# Altium project WS2812LatticeScreen_Project.PrjPcb
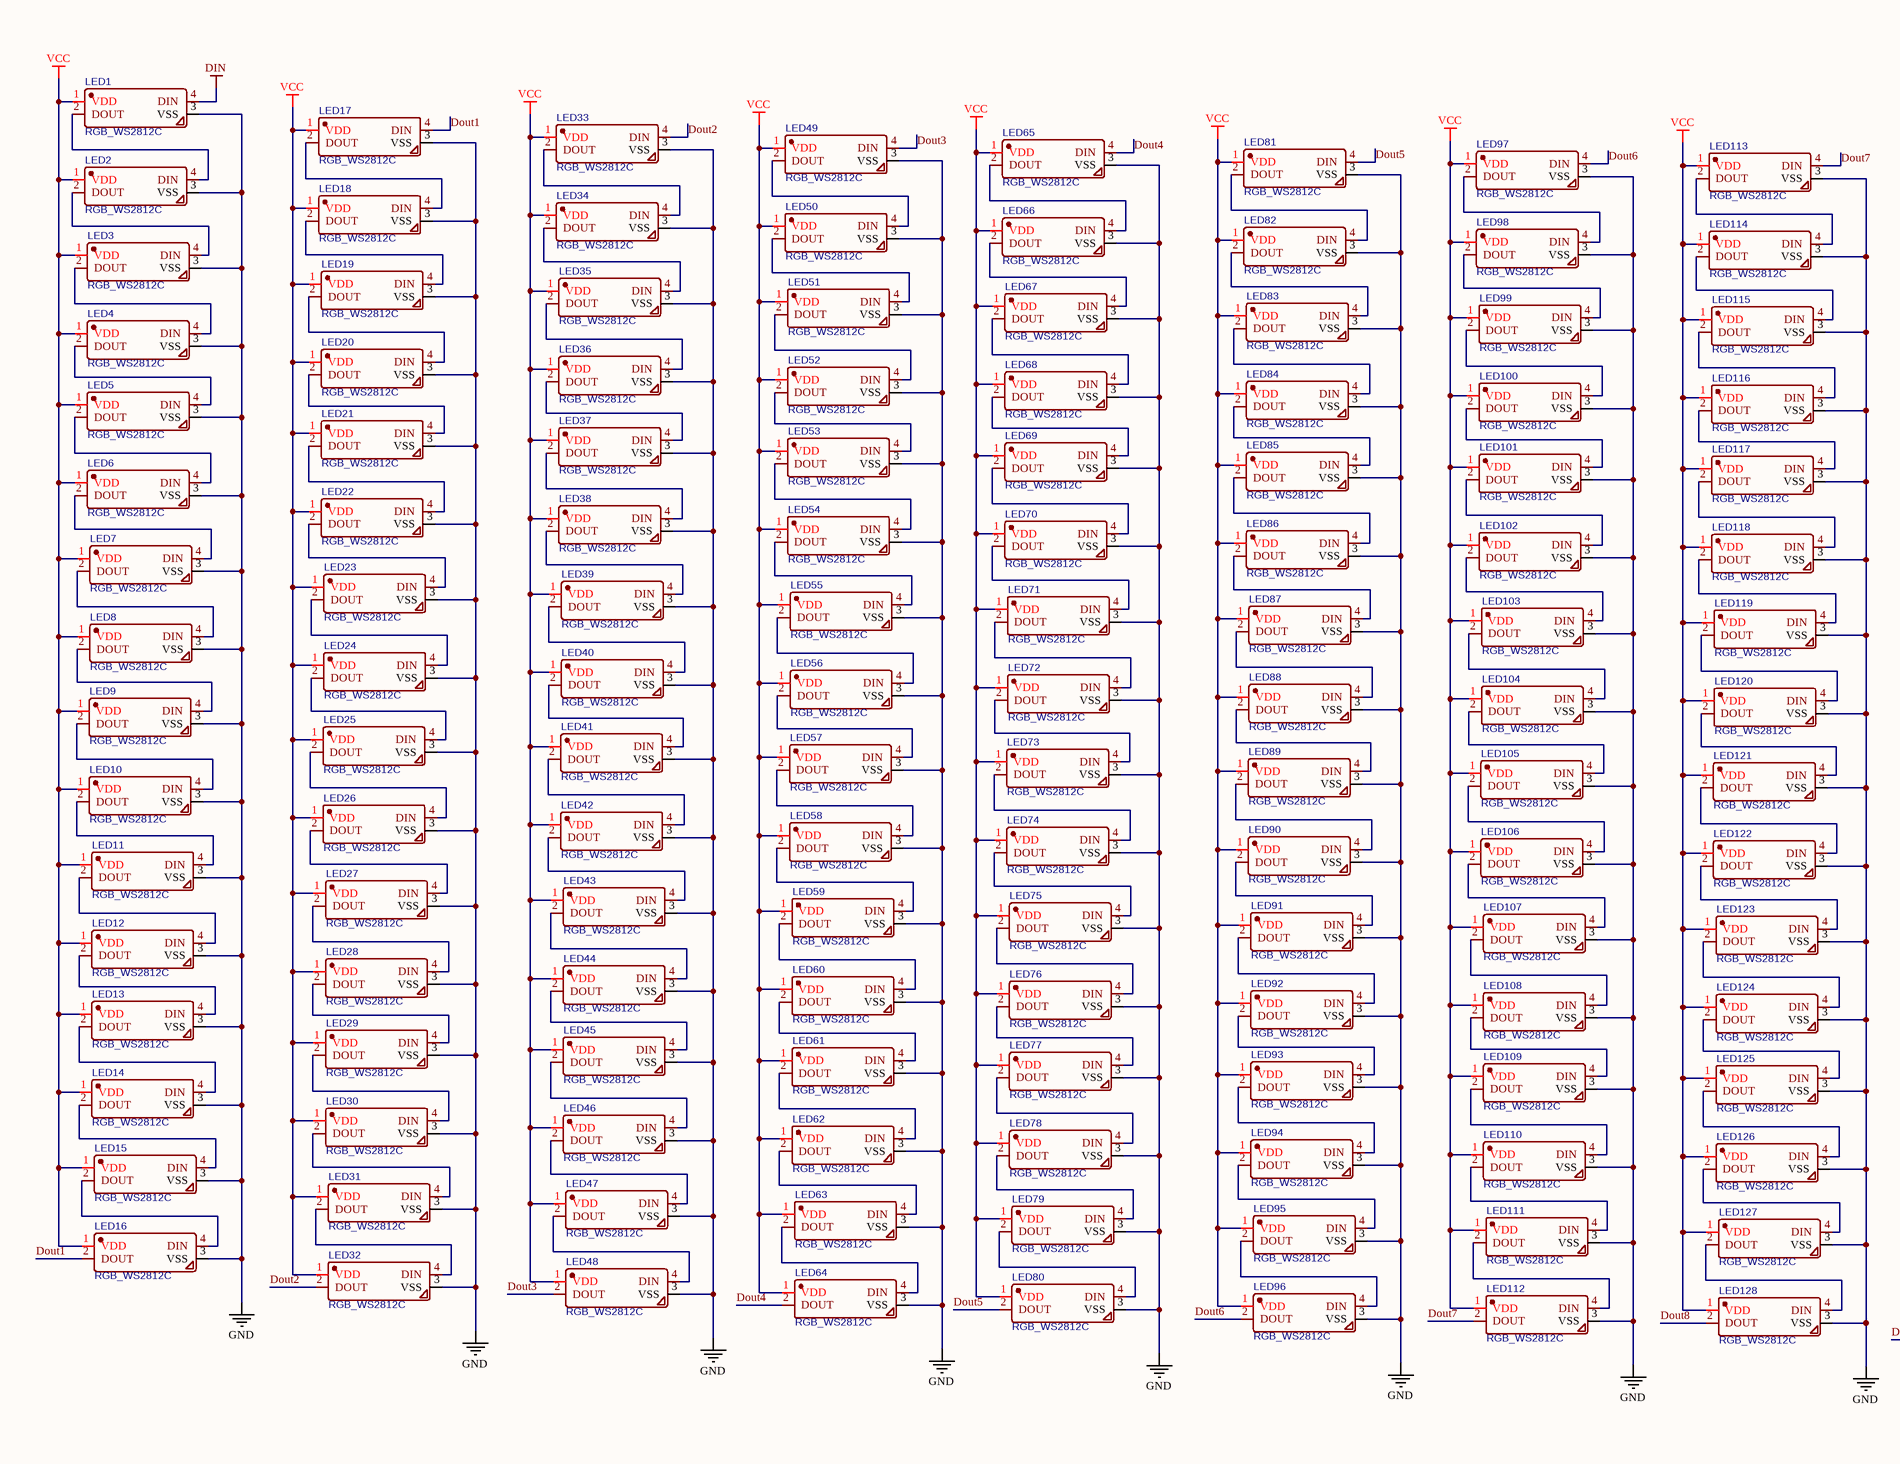
[diagram p0: ScreenRGB.SchDoc, left]
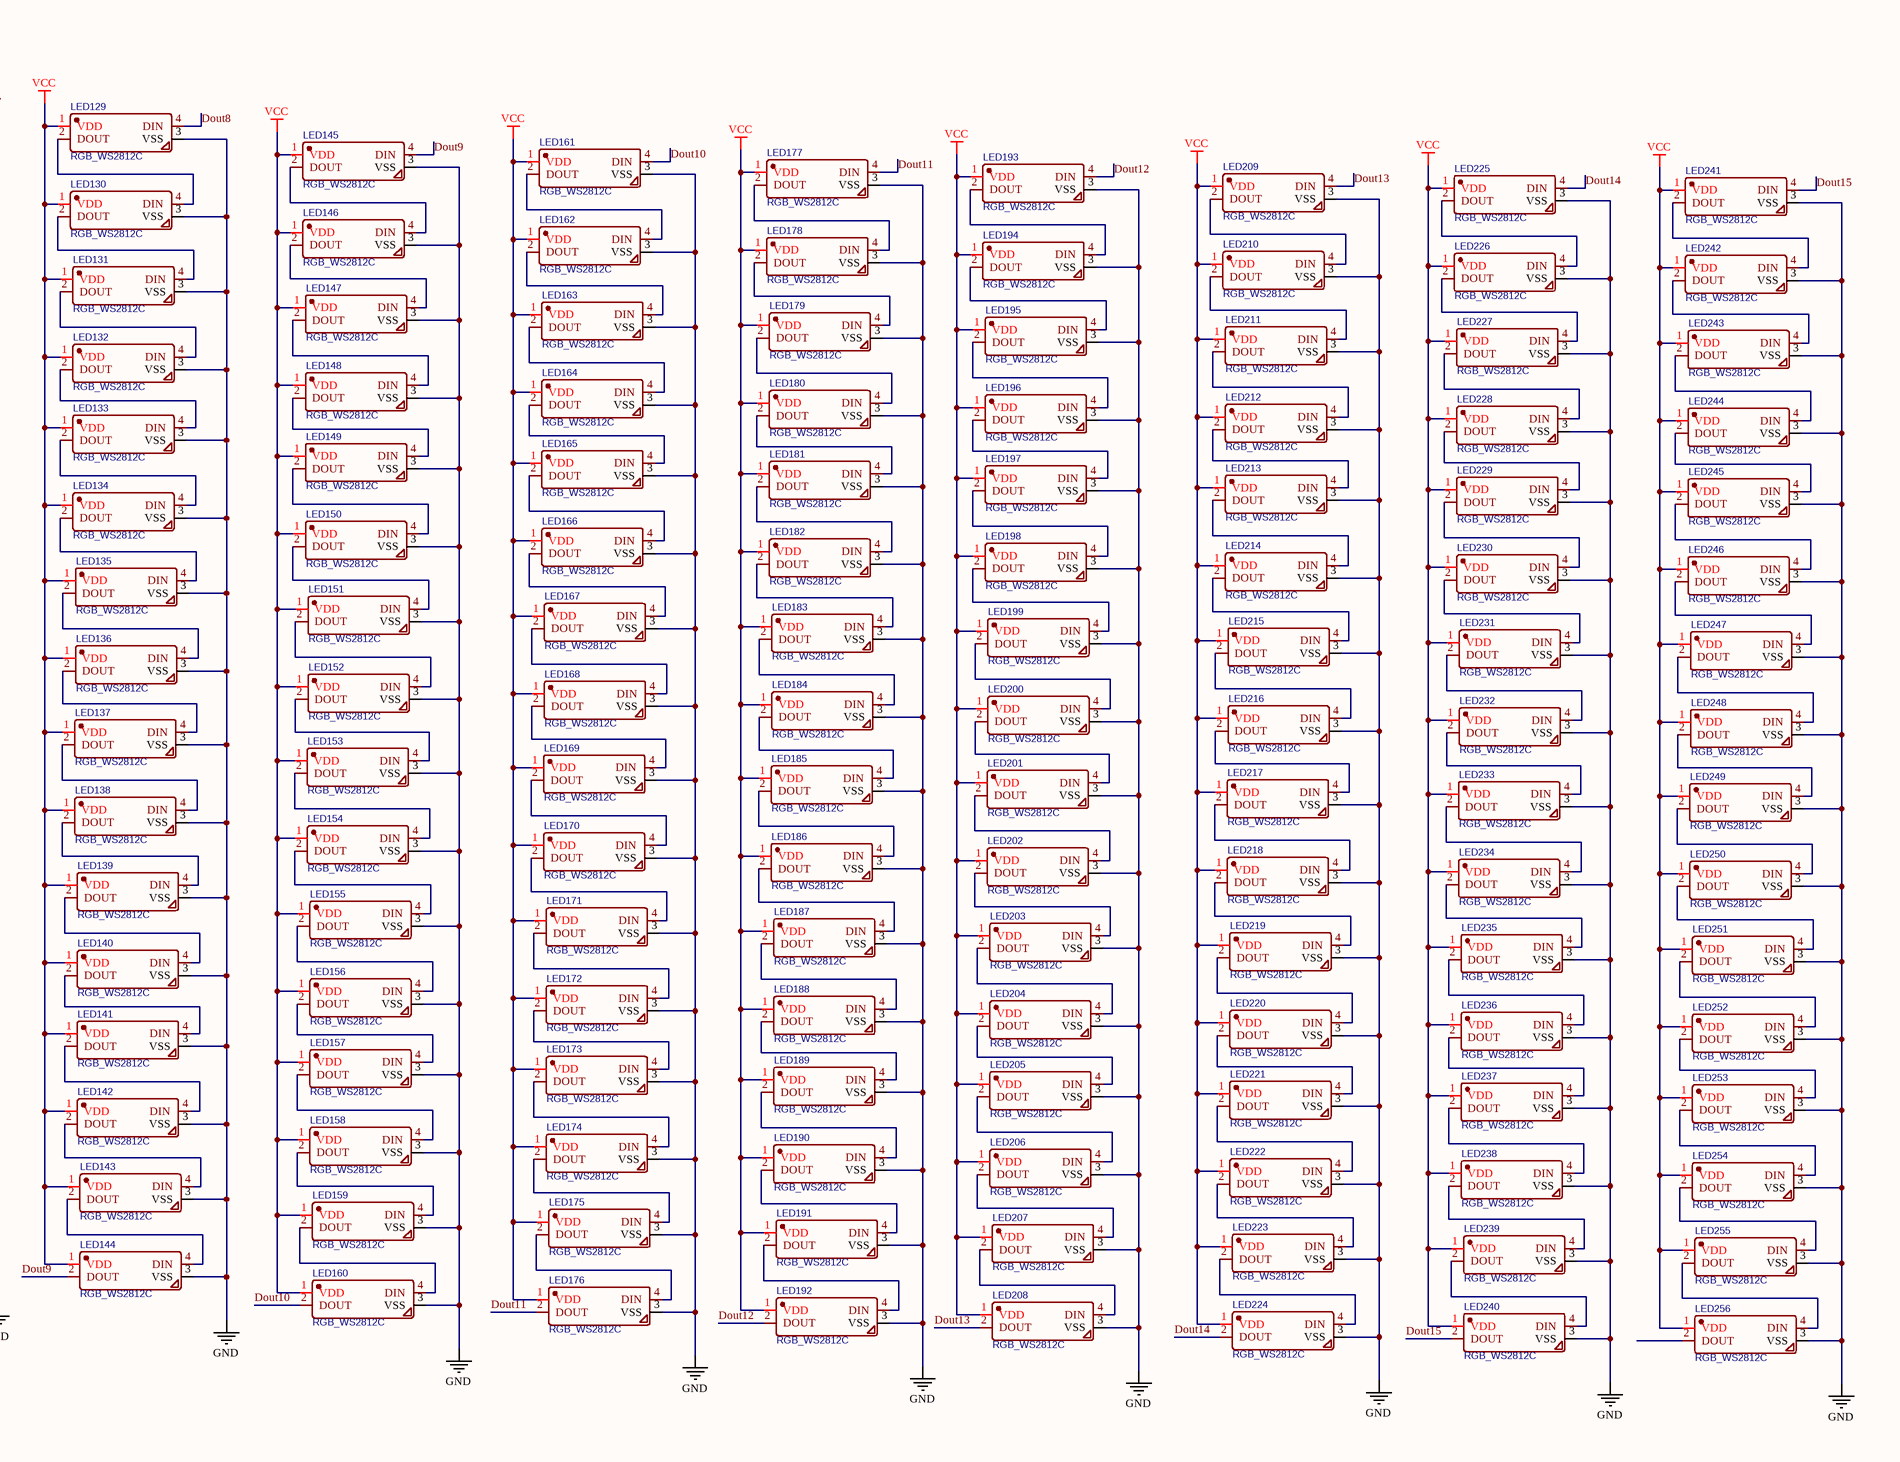
[diagram p1: ScreenRGB.SchDoc, right]
1 sheet, 256 parts. Net scope: global (net labels, ports and power ports of the same name join across sheets).
Board file: ScreenRGB.PcbDoc

## Sheet ScreenRGB.SchDoc
size A1

### Parts
LED1  RGB_WS2812C  [LED_5050-SMD_4P-WS2812]
LED2  RGB_WS2812C  [LED_5050-SMD_4P-WS2812]
LED3  RGB_WS2812C  [LED_5050-SMD_4P-WS2812]
LED4  RGB_WS2812C  [LED_5050-SMD_4P-WS2812]
LED5  RGB_WS2812C  [LED_5050-SMD_4P-WS2812]
LED6  RGB_WS2812C  [LED_5050-SMD_4P-WS2812]
LED7  RGB_WS2812C  [LED_5050-SMD_4P-WS2812]
LED8  RGB_WS2812C  [LED_5050-SMD_4P-WS2812]
LED9  RGB_WS2812C  [LED_5050-SMD_4P-WS2812]
LED10  RGB_WS2812C  [LED_5050-SMD_4P-WS2812]
LED11  RGB_WS2812C  [LED_5050-SMD_4P-WS2812]
LED12  RGB_WS2812C  [LED_5050-SMD_4P-WS2812]
LED13  RGB_WS2812C  [LED_5050-SMD_4P-WS2812]
LED14  RGB_WS2812C  [LED_5050-SMD_4P-WS2812]
LED15  RGB_WS2812C  [LED_5050-SMD_4P-WS2812]
LED16  RGB_WS2812C  [LED_5050-SMD_4P-WS2812]
LED17  RGB_WS2812C  [LED_5050-SMD_4P-WS2812]
LED18  RGB_WS2812C  [LED_5050-SMD_4P-WS2812]
LED19  RGB_WS2812C  [LED_5050-SMD_4P-WS2812]
LED20  RGB_WS2812C  [LED_5050-SMD_4P-WS2812]
LED21  RGB_WS2812C  [LED_5050-SMD_4P-WS2812]
LED22  RGB_WS2812C  [LED_5050-SMD_4P-WS2812]
LED23  RGB_WS2812C  [LED_5050-SMD_4P-WS2812]
LED24  RGB_WS2812C  [LED_5050-SMD_4P-WS2812]
LED25  RGB_WS2812C  [LED_5050-SMD_4P-WS2812]
LED26  RGB_WS2812C  [LED_5050-SMD_4P-WS2812]
LED27  RGB_WS2812C  [LED_5050-SMD_4P-WS2812]
LED28  RGB_WS2812C  [LED_5050-SMD_4P-WS2812]
LED29  RGB_WS2812C  [LED_5050-SMD_4P-WS2812]
LED30  RGB_WS2812C  [LED_5050-SMD_4P-WS2812]
LED31  RGB_WS2812C  [LED_5050-SMD_4P-WS2812]
LED32  RGB_WS2812C  [LED_5050-SMD_4P-WS2812]
LED33  RGB_WS2812C  [LED_5050-SMD_4P-WS2812]
LED34  RGB_WS2812C  [LED_5050-SMD_4P-WS2812]
LED35  RGB_WS2812C  [LED_5050-SMD_4P-WS2812]
LED36  RGB_WS2812C  [LED_5050-SMD_4P-WS2812]
LED37  RGB_WS2812C  [LED_5050-SMD_4P-WS2812]
LED38  RGB_WS2812C  [LED_5050-SMD_4P-WS2812]
LED39  RGB_WS2812C  [LED_5050-SMD_4P-WS2812]
LED40  RGB_WS2812C  [LED_5050-SMD_4P-WS2812]
LED41  RGB_WS2812C  [LED_5050-SMD_4P-WS2812]
LED42  RGB_WS2812C  [LED_5050-SMD_4P-WS2812]
LED43  RGB_WS2812C  [LED_5050-SMD_4P-WS2812]
LED44  RGB_WS2812C  [LED_5050-SMD_4P-WS2812]
LED45  RGB_WS2812C  [LED_5050-SMD_4P-WS2812]
LED46  RGB_WS2812C  [LED_5050-SMD_4P-WS2812]
LED47  RGB_WS2812C  [LED_5050-SMD_4P-WS2812]
LED48  RGB_WS2812C  [LED_5050-SMD_4P-WS2812]
LED49  RGB_WS2812C  [LED_5050-SMD_4P-WS2812]
LED50  RGB_WS2812C  [LED_5050-SMD_4P-WS2812]
LED51  RGB_WS2812C  [LED_5050-SMD_4P-WS2812]
LED52  RGB_WS2812C  [LED_5050-SMD_4P-WS2812]
LED53  RGB_WS2812C  [LED_5050-SMD_4P-WS2812]
LED54  RGB_WS2812C  [LED_5050-SMD_4P-WS2812]
LED55  RGB_WS2812C  [LED_5050-SMD_4P-WS2812]
LED56  RGB_WS2812C  [LED_5050-SMD_4P-WS2812]
LED57  RGB_WS2812C  [LED_5050-SMD_4P-WS2812]
LED58  RGB_WS2812C  [LED_5050-SMD_4P-WS2812]
LED59  RGB_WS2812C  [LED_5050-SMD_4P-WS2812]
LED60  RGB_WS2812C  [LED_5050-SMD_4P-WS2812]
LED61  RGB_WS2812C  [LED_5050-SMD_4P-WS2812]
LED62  RGB_WS2812C  [LED_5050-SMD_4P-WS2812]
LED63  RGB_WS2812C  [LED_5050-SMD_4P-WS2812]
LED64  RGB_WS2812C  [LED_5050-SMD_4P-WS2812]
LED65  RGB_WS2812C  [LED_5050-SMD_4P-WS2812]
LED66  RGB_WS2812C  [LED_5050-SMD_4P-WS2812]
LED67  RGB_WS2812C  [LED_5050-SMD_4P-WS2812]
LED68  RGB_WS2812C  [LED_5050-SMD_4P-WS2812]
LED69  RGB_WS2812C  [LED_5050-SMD_4P-WS2812]
LED70  RGB_WS2812C  [LED_5050-SMD_4P-WS2812]
LED71  RGB_WS2812C  [LED_5050-SMD_4P-WS2812]
LED72  RGB_WS2812C  [LED_5050-SMD_4P-WS2812]
LED73  RGB_WS2812C  [LED_5050-SMD_4P-WS2812]
LED74  RGB_WS2812C  [LED_5050-SMD_4P-WS2812]
LED75  RGB_WS2812C  [LED_5050-SMD_4P-WS2812]
LED76  RGB_WS2812C  [LED_5050-SMD_4P-WS2812]
LED77  RGB_WS2812C  [LED_5050-SMD_4P-WS2812]
LED78  RGB_WS2812C  [LED_5050-SMD_4P-WS2812]
LED79  RGB_WS2812C  [LED_5050-SMD_4P-WS2812]
LED80  RGB_WS2812C  [LED_5050-SMD_4P-WS2812]
LED81  RGB_WS2812C  [LED_5050-SMD_4P-WS2812]
LED82  RGB_WS2812C  [LED_5050-SMD_4P-WS2812]
LED83  RGB_WS2812C  [LED_5050-SMD_4P-WS2812]
LED84  RGB_WS2812C  [LED_5050-SMD_4P-WS2812]
LED85  RGB_WS2812C  [LED_5050-SMD_4P-WS2812]
LED86  RGB_WS2812C  [LED_5050-SMD_4P-WS2812]
LED87  RGB_WS2812C  [LED_5050-SMD_4P-WS2812]
LED88  RGB_WS2812C  [LED_5050-SMD_4P-WS2812]
LED89  RGB_WS2812C  [LED_5050-SMD_4P-WS2812]
LED90  RGB_WS2812C  [LED_5050-SMD_4P-WS2812]
LED91  RGB_WS2812C  [LED_5050-SMD_4P-WS2812]
LED92  RGB_WS2812C  [LED_5050-SMD_4P-WS2812]
LED93  RGB_WS2812C  [LED_5050-SMD_4P-WS2812]
LED94  RGB_WS2812C  [LED_5050-SMD_4P-WS2812]
LED95  RGB_WS2812C  [LED_5050-SMD_4P-WS2812]
LED96  RGB_WS2812C  [LED_5050-SMD_4P-WS2812]
LED97  RGB_WS2812C  [LED_5050-SMD_4P-WS2812]
LED98  RGB_WS2812C  [LED_5050-SMD_4P-WS2812]
LED99  RGB_WS2812C  [LED_5050-SMD_4P-WS2812]
LED100  RGB_WS2812C  [LED_5050-SMD_4P-WS2812]
LED101  RGB_WS2812C  [LED_5050-SMD_4P-WS2812]
LED102  RGB_WS2812C  [LED_5050-SMD_4P-WS2812]
LED103  RGB_WS2812C  [LED_5050-SMD_4P-WS2812]
LED104  RGB_WS2812C  [LED_5050-SMD_4P-WS2812]
LED105  RGB_WS2812C  [LED_5050-SMD_4P-WS2812]
LED106  RGB_WS2812C  [LED_5050-SMD_4P-WS2812]
LED107  RGB_WS2812C  [LED_5050-SMD_4P-WS2812]
LED108  RGB_WS2812C  [LED_5050-SMD_4P-WS2812]
LED109  RGB_WS2812C  [LED_5050-SMD_4P-WS2812]
LED110  RGB_WS2812C  [LED_5050-SMD_4P-WS2812]
LED111  RGB_WS2812C  [LED_5050-SMD_4P-WS2812]
LED112  RGB_WS2812C  [LED_5050-SMD_4P-WS2812]
LED113  RGB_WS2812C  [LED_5050-SMD_4P-WS2812]
LED114  RGB_WS2812C  [LED_5050-SMD_4P-WS2812]
LED115  RGB_WS2812C  [LED_5050-SMD_4P-WS2812]
LED116  RGB_WS2812C  [LED_5050-SMD_4P-WS2812]
LED117  RGB_WS2812C  [LED_5050-SMD_4P-WS2812]
LED118  RGB_WS2812C  [LED_5050-SMD_4P-WS2812]
LED119  RGB_WS2812C  [LED_5050-SMD_4P-WS2812]
LED120  RGB_WS2812C  [LED_5050-SMD_4P-WS2812]
LED121  RGB_WS2812C  [LED_5050-SMD_4P-WS2812]
LED122  RGB_WS2812C  [LED_5050-SMD_4P-WS2812]
LED123  RGB_WS2812C  [LED_5050-SMD_4P-WS2812]
LED124  RGB_WS2812C  [LED_5050-SMD_4P-WS2812]
LED125  RGB_WS2812C  [LED_5050-SMD_4P-WS2812]
LED126  RGB_WS2812C  [LED_5050-SMD_4P-WS2812]
LED127  RGB_WS2812C  [LED_5050-SMD_4P-WS2812]
LED128  RGB_WS2812C  [LED_5050-SMD_4P-WS2812]
LED129  RGB_WS2812C  [LED_5050-SMD_4P-WS2812]
LED130  RGB_WS2812C  [LED_5050-SMD_4P-WS2812]
LED131  RGB_WS2812C  [LED_5050-SMD_4P-WS2812]
LED132  RGB_WS2812C  [LED_5050-SMD_4P-WS2812]
LED133  RGB_WS2812C  [LED_5050-SMD_4P-WS2812]
LED134  RGB_WS2812C  [LED_5050-SMD_4P-WS2812]
LED135  RGB_WS2812C  [LED_5050-SMD_4P-WS2812]
LED136  RGB_WS2812C  [LED_5050-SMD_4P-WS2812]
LED137  RGB_WS2812C  [LED_5050-SMD_4P-WS2812]
LED138  RGB_WS2812C  [LED_5050-SMD_4P-WS2812]
LED139  RGB_WS2812C  [LED_5050-SMD_4P-WS2812]
LED140  RGB_WS2812C  [LED_5050-SMD_4P-WS2812]
LED141  RGB_WS2812C  [LED_5050-SMD_4P-WS2812]
LED142  RGB_WS2812C  [LED_5050-SMD_4P-WS2812]
LED143  RGB_WS2812C  [LED_5050-SMD_4P-WS2812]
LED144  RGB_WS2812C  [LED_5050-SMD_4P-WS2812]
LED145  RGB_WS2812C  [LED_5050-SMD_4P-WS2812]
LED146  RGB_WS2812C  [LED_5050-SMD_4P-WS2812]
LED147  RGB_WS2812C  [LED_5050-SMD_4P-WS2812]
LED148  RGB_WS2812C  [LED_5050-SMD_4P-WS2812]
LED149  RGB_WS2812C  [LED_5050-SMD_4P-WS2812]
LED150  RGB_WS2812C  [LED_5050-SMD_4P-WS2812]
LED151  RGB_WS2812C  [LED_5050-SMD_4P-WS2812]
LED152  RGB_WS2812C  [LED_5050-SMD_4P-WS2812]
LED153  RGB_WS2812C  [LED_5050-SMD_4P-WS2812]
LED154  RGB_WS2812C  [LED_5050-SMD_4P-WS2812]
LED155  RGB_WS2812C  [LED_5050-SMD_4P-WS2812]
LED156  RGB_WS2812C  [LED_5050-SMD_4P-WS2812]
LED157  RGB_WS2812C  [LED_5050-SMD_4P-WS2812]
LED158  RGB_WS2812C  [LED_5050-SMD_4P-WS2812]
LED159  RGB_WS2812C  [LED_5050-SMD_4P-WS2812]
LED160  RGB_WS2812C  [LED_5050-SMD_4P-WS2812]
LED161  RGB_WS2812C  [LED_5050-SMD_4P-WS2812]
LED162  RGB_WS2812C  [LED_5050-SMD_4P-WS2812]
LED163  RGB_WS2812C  [LED_5050-SMD_4P-WS2812]
LED164  RGB_WS2812C  [LED_5050-SMD_4P-WS2812]
LED165  RGB_WS2812C  [LED_5050-SMD_4P-WS2812]
LED166  RGB_WS2812C  [LED_5050-SMD_4P-WS2812]
LED167  RGB_WS2812C  [LED_5050-SMD_4P-WS2812]
LED168  RGB_WS2812C  [LED_5050-SMD_4P-WS2812]
LED169  RGB_WS2812C  [LED_5050-SMD_4P-WS2812]
LED170  RGB_WS2812C  [LED_5050-SMD_4P-WS2812]
LED171  RGB_WS2812C  [LED_5050-SMD_4P-WS2812]
LED172  RGB_WS2812C  [LED_5050-SMD_4P-WS2812]
LED173  RGB_WS2812C  [LED_5050-SMD_4P-WS2812]
LED174  RGB_WS2812C  [LED_5050-SMD_4P-WS2812]
LED175  RGB_WS2812C  [LED_5050-SMD_4P-WS2812]
LED176  RGB_WS2812C  [LED_5050-SMD_4P-WS2812]
LED177  RGB_WS2812C  [LED_5050-SMD_4P-WS2812]
LED178  RGB_WS2812C  [LED_5050-SMD_4P-WS2812]
LED179  RGB_WS2812C  [LED_5050-SMD_4P-WS2812]
LED180  RGB_WS2812C  [LED_5050-SMD_4P-WS2812]
LED181  RGB_WS2812C  [LED_5050-SMD_4P-WS2812]
LED182  RGB_WS2812C  [LED_5050-SMD_4P-WS2812]
LED183  RGB_WS2812C  [LED_5050-SMD_4P-WS2812]
LED184  RGB_WS2812C  [LED_5050-SMD_4P-WS2812]
LED185  RGB_WS2812C  [LED_5050-SMD_4P-WS2812]
LED186  RGB_WS2812C  [LED_5050-SMD_4P-WS2812]
LED187  RGB_WS2812C  [LED_5050-SMD_4P-WS2812]
LED188  RGB_WS2812C  [LED_5050-SMD_4P-WS2812]
LED189  RGB_WS2812C  [LED_5050-SMD_4P-WS2812]
LED190  RGB_WS2812C  [LED_5050-SMD_4P-WS2812]
LED191  RGB_WS2812C  [LED_5050-SMD_4P-WS2812]
LED192  RGB_WS2812C  [LED_5050-SMD_4P-WS2812]
LED193  RGB_WS2812C  [LED_5050-SMD_4P-WS2812]
LED194  RGB_WS2812C  [LED_5050-SMD_4P-WS2812]
LED195  RGB_WS2812C  [LED_5050-SMD_4P-WS2812]
LED196  RGB_WS2812C  [LED_5050-SMD_4P-WS2812]
LED197  RGB_WS2812C  [LED_5050-SMD_4P-WS2812]
LED198  RGB_WS2812C  [LED_5050-SMD_4P-WS2812]
LED199  RGB_WS2812C  [LED_5050-SMD_4P-WS2812]
LED200  RGB_WS2812C  [LED_5050-SMD_4P-WS2812]
LED201  RGB_WS2812C  [LED_5050-SMD_4P-WS2812]
LED202  RGB_WS2812C  [LED_5050-SMD_4P-WS2812]
LED203  RGB_WS2812C  [LED_5050-SMD_4P-WS2812]
LED204  RGB_WS2812C  [LED_5050-SMD_4P-WS2812]
LED205  RGB_WS2812C  [LED_5050-SMD_4P-WS2812]
LED206  RGB_WS2812C  [LED_5050-SMD_4P-WS2812]
LED207  RGB_WS2812C  [LED_5050-SMD_4P-WS2812]
LED208  RGB_WS2812C  [LED_5050-SMD_4P-WS2812]
LED209  RGB_WS2812C  [LED_5050-SMD_4P-WS2812]
LED210  RGB_WS2812C  [LED_5050-SMD_4P-WS2812]
LED211  RGB_WS2812C  [LED_5050-SMD_4P-WS2812]
LED212  RGB_WS2812C  [LED_5050-SMD_4P-WS2812]
LED213  RGB_WS2812C  [LED_5050-SMD_4P-WS2812]
LED214  RGB_WS2812C  [LED_5050-SMD_4P-WS2812]
LED215  RGB_WS2812C  [LED_5050-SMD_4P-WS2812]
LED216  RGB_WS2812C  [LED_5050-SMD_4P-WS2812]
LED217  RGB_WS2812C  [LED_5050-SMD_4P-WS2812]
LED218  RGB_WS2812C  [LED_5050-SMD_4P-WS2812]
LED219  RGB_WS2812C  [LED_5050-SMD_4P-WS2812]
LED220  RGB_WS2812C  [LED_5050-SMD_4P-WS2812]
LED221  RGB_WS2812C  [LED_5050-SMD_4P-WS2812]
LED222  RGB_WS2812C  [LED_5050-SMD_4P-WS2812]
LED223  RGB_WS2812C  [LED_5050-SMD_4P-WS2812]
LED224  RGB_WS2812C  [LED_5050-SMD_4P-WS2812]
LED225  RGB_WS2812C  [LED_5050-SMD_4P-WS2812]
LED226  RGB_WS2812C  [LED_5050-SMD_4P-WS2812]
LED227  RGB_WS2812C  [LED_5050-SMD_4P-WS2812]
LED228  RGB_WS2812C  [LED_5050-SMD_4P-WS2812]
LED229  RGB_WS2812C  [LED_5050-SMD_4P-WS2812]
LED230  RGB_WS2812C  [LED_5050-SMD_4P-WS2812]
LED231  RGB_WS2812C  [LED_5050-SMD_4P-WS2812]
LED232  RGB_WS2812C  [LED_5050-SMD_4P-WS2812]
LED233  RGB_WS2812C  [LED_5050-SMD_4P-WS2812]
LED234  RGB_WS2812C  [LED_5050-SMD_4P-WS2812]
LED235  RGB_WS2812C  [LED_5050-SMD_4P-WS2812]
LED236  RGB_WS2812C  [LED_5050-SMD_4P-WS2812]
LED237  RGB_WS2812C  [LED_5050-SMD_4P-WS2812]
LED238  RGB_WS2812C  [LED_5050-SMD_4P-WS2812]
LED239  RGB_WS2812C  [LED_5050-SMD_4P-WS2812]
LED240  RGB_WS2812C  [LED_5050-SMD_4P-WS2812]
LED241  RGB_WS2812C  [LED_5050-SMD_4P-WS2812]
LED242  RGB_WS2812C  [LED_5050-SMD_4P-WS2812]
LED243  RGB_WS2812C  [LED_5050-SMD_4P-WS2812]
LED244  RGB_WS2812C  [LED_5050-SMD_4P-WS2812]
LED245  RGB_WS2812C  [LED_5050-SMD_4P-WS2812]
LED246  RGB_WS2812C  [LED_5050-SMD_4P-WS2812]
LED247  RGB_WS2812C  [LED_5050-SMD_4P-WS2812]
LED248  RGB_WS2812C  [LED_5050-SMD_4P-WS2812]
LED249  RGB_WS2812C  [LED_5050-SMD_4P-WS2812]
LED250  RGB_WS2812C  [LED_5050-SMD_4P-WS2812]
LED251  RGB_WS2812C  [LED_5050-SMD_4P-WS2812]
LED252  RGB_WS2812C  [LED_5050-SMD_4P-WS2812]
LED253  RGB_WS2812C  [LED_5050-SMD_4P-WS2812]
LED254  RGB_WS2812C  [LED_5050-SMD_4P-WS2812]
LED255  RGB_WS2812C  [LED_5050-SMD_4P-WS2812]
LED256  RGB_WS2812C  [LED_5050-SMD_4P-WS2812]

### Nets
DIN: LED1.4(DIN)
GND: LED1.3(VSS) LED2.3(VSS) LED3.3(VSS) LED4.3(VSS) LED5.3(VSS) LED6.3(VSS) LED7.3(VSS) LED8.3(VSS) LED9.3(VSS) LED10.3(VSS) LED11.3(VSS) LED12.3(VSS) LED13.3(VSS) LED14.3(VSS) LED15.3(VSS) LED16.3(VSS) LED17.3(VSS) LED18.3(VSS) LED19.3(VSS) LED20.3(VSS) LED21.3(VSS) LED22.3(VSS) LED23.3(VSS) LED24.3(VSS) LED25.3(VSS) LED26.3(VSS) LED27.3(VSS) LED28.3(VSS) LED29.3(VSS) LED30.3(VSS) LED31.3(VSS) LED32.3(VSS) LED33.3(VSS) LED34.3(VSS) LED35.3(VSS) LED36.3(VSS) LED37.3(VSS) LED38.3(VSS) LED39.3(VSS) LED40.3(VSS) LED41.3(VSS) LED42.3(VSS) LED43.3(VSS) LED44.3(VSS) LED45.3(VSS) LED46.3(VSS) LED47.3(VSS) LED48.3(VSS) LED49.3(VSS) LED50.3(VSS) LED51.3(VSS) LED52.3(VSS) LED53.3(VSS) LED54.3(VSS) LED55.3(VSS) LED56.3(VSS) LED57.3(VSS) LED58.3(VSS) LED59.3(VSS) LED60.3(VSS) LED61.3(VSS) LED62.3(VSS) LED63.3(VSS) LED64.3(VSS) LED65.3(VSS) LED66.3(VSS) LED67.3(VSS) LED68.3(VSS) LED69.3(VSS) LED70.3(VSS) LED71.3(VSS) LED72.3(VSS) LED73.3(VSS) LED74.3(VSS) LED75.3(VSS) LED76.3(VSS) LED77.3(VSS) LED78.3(VSS) LED79.3(VSS) LED80.3(VSS) LED81.3(VSS) LED82.3(VSS) LED83.3(VSS) LED84.3(VSS) LED85.3(VSS) LED86.3(VSS) LED87.3(VSS) LED88.3(VSS) LED89.3(VSS) LED90.3(VSS) LED91.3(VSS) LED92.3(VSS) LED93.3(VSS) LED94.3(VSS) LED95.3(VSS) LED96.3(VSS) LED97.3(VSS) LED98.3(VSS) LED99.3(VSS) LED100.3(VSS) LED101.3(VSS) LED102.3(VSS) LED103.3(VSS) LED104.3(VSS) LED105.3(VSS) LED106.3(VSS) LED107.3(VSS) LED108.3(VSS) LED109.3(VSS) LED110.3(VSS) LED111.3(VSS) LED112.3(VSS) LED113.3(VSS) LED114.3(VSS) LED115.3(VSS) LED116.3(VSS) LED117.3(VSS) LED118.3(VSS) LED119.3(VSS) LED120.3(VSS) LED121.3(VSS) LED122.3(VSS) LED123.3(VSS) LED124.3(VSS) LED125.3(VSS) LED126.3(VSS) LED127.3(VSS) LED128.3(VSS) LED129.3(VSS) LED130.3(VSS) LED131.3(VSS) LED132.3(VSS) LED133.3(VSS) LED134.3(VSS) LED135.3(VSS) LED136.3(VSS) LED137.3(VSS) LED138.3(VSS) LED139.3(VSS) LED140.3(VSS) LED141.3(VSS) LED142.3(VSS) LED143.3(VSS) LED144.3(VSS) LED145.3(VSS) LED146.3(VSS) LED147.3(VSS) LED148.3(VSS) LED149.3(VSS) LED150.3(VSS) LED151.3(VSS) LED152.3(VSS) LED153.3(VSS) LED154.3(VSS) LED155.3(VSS) LED156.3(VSS) LED157.3(VSS) LED158.3(VSS) LED159.3(VSS) LED160.3(VSS) LED161.3(VSS) LED162.3(VSS) LED163.3(VSS) LED164.3(VSS) LED165.3(VSS) LED166.3(VSS) LED167.3(VSS) LED168.3(VSS) LED169.3(VSS) LED170.3(VSS) LED171.3(VSS) LED172.3(VSS) LED173.3(VSS) LED174.3(VSS) LED175.3(VSS) LED176.3(VSS) LED177.3(VSS) LED178.3(VSS) LED179.3(VSS) LED180.3(VSS) LED181.3(VSS) LED182.3(VSS) LED183.3(VSS) LED184.3(VSS) LED185.3(VSS) LED186.3(VSS) LED187.3(VSS) LED188.3(VSS) LED189.3(VSS) LED190.3(VSS) LED191.3(VSS) LED192.3(VSS) LED193.3(VSS) LED194.3(VSS) LED195.3(VSS) LED196.3(VSS) LED197.3(VSS) LED198.3(VSS) LED199.3(VSS) LED200.3(VSS) LED201.3(VSS) LED202.3(VSS) LED203.3(VSS) LED204.3(VSS) LED205.3(VSS) LED206.3(VSS) LED207.3(VSS) LED208.3(VSS) LED209.3(VSS) LED210.3(VSS) LED211.3(VSS) LED212.3(VSS) LED213.3(VSS) LED214.3(VSS) LED215.3(VSS) LED216.3(VSS) LED217.3(VSS) LED218.3(VSS) LED219.3(VSS) LED220.3(VSS) LED221.3(VSS) LED222.3(VSS) LED223.3(VSS) LED224.3(VSS) LED225.3(VSS) LED226.3(VSS) LED227.3(VSS) LED228.3(VSS) LED229.3(VSS) LED230.3(VSS) LED231.3(VSS) LED232.3(VSS) LED233.3(VSS) LED234.3(VSS) LED235.3(VSS) LED236.3(VSS) LED237.3(VSS) LED238.3(VSS) LED239.3(VSS) LED240.3(VSS) LED241.3(VSS) LED242.3(VSS) LED243.3(VSS) LED244.3(VSS) LED245.3(VSS) LED246.3(VSS) LED247.3(VSS) LED248.3(VSS) LED249.3(VSS) LED250.3(VSS) LED251.3(VSS) LED252.3(VSS) LED253.3(VSS) LED254.3(VSS) LED255.3(VSS) LED256.3(VSS)
VCC: LED1.1(VDD) LED2.1(VDD) LED3.1(VDD) LED4.1(VDD) LED5.1(VDD) LED6.1(VDD) LED7.1(VDD) LED8.1(VDD) LED9.1(VDD) LED10.1(VDD) LED11.1(VDD) LED12.1(VDD) LED13.1(VDD) LED14.1(VDD) LED15.1(VDD) LED16.1(VDD) LED17.1(VDD) LED18.1(VDD) LED19.1(VDD) LED20.1(VDD) LED21.1(VDD) LED22.1(VDD) LED23.1(VDD) LED24.1(VDD) LED25.1(VDD) LED26.1(VDD) LED27.1(VDD) LED28.1(VDD) LED29.1(VDD) LED30.1(VDD) LED31.1(VDD) LED32.1(VDD) LED33.1(VDD) LED34.1(VDD) LED35.1(VDD) LED36.1(VDD) LED37.1(VDD) LED38.1(VDD) LED39.1(VDD) LED40.1(VDD) LED41.1(VDD) LED42.1(VDD) LED43.1(VDD) LED44.1(VDD) LED45.1(VDD) LED46.1(VDD) LED47.1(VDD) LED48.1(VDD) LED49.1(VDD) LED50.1(VDD) LED51.1(VDD) LED52.1(VDD) LED53.1(VDD) LED54.1(VDD) LED55.1(VDD) LED56.1(VDD) LED57.1(VDD) LED58.1(VDD) LED59.1(VDD) LED60.1(VDD) LED61.1(VDD) LED62.1(VDD) LED63.1(VDD) LED64.1(VDD) LED65.1(VDD) LED66.1(VDD) LED67.1(VDD) LED68.1(VDD) LED69.1(VDD) LED70.1(VDD) LED71.1(VDD) LED72.1(VDD) LED73.1(VDD) LED74.1(VDD) LED75.1(VDD) LED76.1(VDD) LED77.1(VDD) LED78.1(VDD) LED79.1(VDD) LED80.1(VDD) LED81.1(VDD) LED82.1(VDD) LED83.1(VDD) LED84.1(VDD) LED85.1(VDD) LED86.1(VDD) LED87.1(VDD) LED88.1(VDD) LED89.1(VDD) LED90.1(VDD) LED91.1(VDD) LED92.1(VDD) LED93.1(VDD) LED94.1(VDD) LED95.1(VDD) LED96.1(VDD) LED97.1(VDD) LED98.1(VDD) LED99.1(VDD) LED100.1(VDD) LED101.1(VDD) LED102.1(VDD) LED103.1(VDD) LED104.1(VDD) LED105.1(VDD) LED106.1(VDD) LED107.1(VDD) LED108.1(VDD) LED109.1(VDD) LED110.1(VDD) LED111.1(VDD) LED112.1(VDD) LED113.1(VDD) LED114.1(VDD) LED115.1(VDD) LED116.1(VDD) LED117.1(VDD) LED118.1(VDD) LED119.1(VDD) LED120.1(VDD) LED121.1(VDD) LED122.1(VDD) LED123.1(VDD) LED124.1(VDD) LED125.1(VDD) LED126.1(VDD) LED127.1(VDD) LED128.1(VDD) LED129.1(VDD) LED130.1(VDD) LED131.1(VDD) LED132.1(VDD) LED133.1(VDD) LED134.1(VDD) LED135.1(VDD) LED136.1(VDD) LED137.1(VDD) LED138.1(VDD) LED139.1(VDD) LED140.1(VDD) LED141.1(VDD) LED142.1(VDD) LED143.1(VDD) LED144.1(VDD) LED145.1(VDD) LED146.1(VDD) LED147.1(VDD) LED148.1(VDD) LED149.1(VDD) LED150.1(VDD) LED151.1(VDD) LED152.1(VDD) LED153.1(VDD) LED154.1(VDD) LED155.1(VDD) LED156.1(VDD) LED157.1(VDD) LED158.1(VDD) LED159.1(VDD) LED160.1(VDD) LED161.1(VDD) LED162.1(VDD) LED163.1(VDD) LED164.1(VDD) LED165.1(VDD) LED166.1(VDD) LED167.1(VDD) LED168.1(VDD) LED169.1(VDD) LED170.1(VDD) LED171.1(VDD) LED172.1(VDD) LED173.1(VDD) LED174.1(VDD) LED175.1(VDD) LED176.1(VDD) LED177.1(VDD) LED178.1(VDD) LED179.1(VDD) LED180.1(VDD) LED181.1(VDD) LED182.1(VDD) LED183.1(VDD) LED184.1(VDD) LED185.1(VDD) LED186.1(VDD) LED187.1(VDD) LED188.1(VDD) LED189.1(VDD) LED190.1(VDD) LED191.1(VDD) LED192.1(VDD) LED193.1(VDD) LED194.1(VDD) LED195.1(VDD) LED196.1(VDD) LED197.1(VDD) LED198.1(VDD) LED199.1(VDD) LED200.1(VDD) LED201.1(VDD) LED202.1(VDD) LED203.1(VDD) LED204.1(VDD) LED205.1(VDD) LED206.1(VDD) LED207.1(VDD) LED208.1(VDD) LED209.1(VDD) LED210.1(VDD) LED211.1(VDD) LED212.1(VDD) LED213.1(VDD) LED214.1(VDD) LED215.1(VDD) LED216.1(VDD) LED217.1(VDD) LED218.1(VDD) LED219.1(VDD) LED220.1(VDD) LED221.1(VDD) LED222.1(VDD) LED223.1(VDD) LED224.1(VDD) LED225.1(VDD) LED226.1(VDD) LED227.1(VDD) LED228.1(VDD) LED229.1(VDD) LED230.1(VDD) LED231.1(VDD) LED232.1(VDD) LED233.1(VDD) LED234.1(VDD) LED235.1(VDD) LED236.1(VDD) LED237.1(VDD) LED238.1(VDD) LED239.1(VDD) LED240.1(VDD) LED241.1(VDD) LED242.1(VDD) LED243.1(VDD) LED244.1(VDD) LED245.1(VDD) LED246.1(VDD) LED247.1(VDD) LED248.1(VDD) LED249.1(VDD) LED250.1(VDD) LED251.1(VDD) LED252.1(VDD) LED253.1(VDD) LED254.1(VDD) LED255.1(VDD) LED256.1(VDD)
Dout1: LED16.2(DOUT) LED17.4(DIN)
Dout2: LED32.2(DOUT) LED33.4(DIN)
Dout3: LED48.2(DOUT) LED49.4(DIN)
Dout4: LED64.2(DOUT) LED65.4(DIN)
Dout5: LED80.2(DOUT) LED81.4(DIN)
Dout6: LED96.2(DOUT) LED97.4(DIN)
Dout7: LED112.2(DOUT) LED113.4(DIN)
Dout8: LED128.2(DOUT) LED129.4(DIN)
Dout9: LED144.2(DOUT) LED145.4(DIN)
Dout10: LED160.2(DOUT) LED161.4(DIN)
Dout11: LED176.2(DOUT) LED177.4(DIN)
Dout12: LED192.2(DOUT) LED193.4(DIN)
Dout13: LED208.2(DOUT) LED209.4(DIN)
Dout14: LED224.2(DOUT) LED225.4(DIN)
Dout15: LED240.2(DOUT) LED241.4(DIN)
NetLED1_2: LED1.2(DOUT) LED2.4(DIN)
NetLED2_2: LED2.2(DOUT) LED3.4(DIN)
NetLED3_2: LED3.2(DOUT) LED4.4(DIN)
NetLED4_2: LED4.2(DOUT) LED5.4(DIN)
NetLED5_2: LED5.2(DOUT) LED6.4(DIN)
NetLED6_2: LED6.2(DOUT) LED7.4(DIN)
NetLED7_2: LED7.2(DOUT) LED8.4(DIN)
NetLED8_2: LED8.2(DOUT) LED9.4(DIN)
NetLED9_2: LED9.2(DOUT) LED10.4(DIN)
NetLED10_2: LED10.2(DOUT) LED11.4(DIN)
NetLED11_2: LED11.2(DOUT) LED12.4(DIN)
NetLED12_2: LED12.2(DOUT) LED13.4(DIN)
NetLED13_2: LED13.2(DOUT) LED14.4(DIN)
NetLED14_2: LED14.2(DOUT) LED15.4(DIN)
NetLED15_2: LED15.2(DOUT) LED16.4(DIN)
NetLED17_2: LED17.2(DOUT) LED18.4(DIN)
NetLED18_2: LED18.2(DOUT) LED19.4(DIN)
NetLED19_2: LED19.2(DOUT) LED20.4(DIN)
NetLED20_2: LED20.2(DOUT) LED21.4(DIN)
NetLED21_2: LED21.2(DOUT) LED22.4(DIN)
NetLED22_2: LED22.2(DOUT) LED23.4(DIN)
NetLED23_2: LED23.2(DOUT) LED24.4(DIN)
NetLED24_2: LED24.2(DOUT) LED25.4(DIN)
NetLED25_2: LED25.2(DOUT) LED26.4(DIN)
NetLED26_2: LED26.2(DOUT) LED27.4(DIN)
NetLED27_2: LED27.2(DOUT) LED28.4(DIN)
NetLED28_2: LED28.2(DOUT) LED29.4(DIN)
NetLED29_2: LED29.2(DOUT) LED30.4(DIN)
NetLED30_2: LED30.2(DOUT) LED31.4(DIN)
NetLED31_2: LED31.2(DOUT) LED32.4(DIN)
NetLED33_2: LED33.2(DOUT) LED34.4(DIN)
NetLED34_2: LED34.2(DOUT) LED35.4(DIN)
NetLED35_2: LED35.2(DOUT) LED36.4(DIN)
NetLED36_2: LED36.2(DOUT) LED37.4(DIN)
NetLED37_2: LED37.2(DOUT) LED38.4(DIN)
NetLED38_2: LED38.2(DOUT) LED39.4(DIN)
NetLED39_2: LED39.2(DOUT) LED40.4(DIN)
NetLED40_2: LED40.2(DOUT) LED41.4(DIN)
NetLED41_2: LED41.2(DOUT) LED42.4(DIN)
NetLED42_2: LED42.2(DOUT) LED43.4(DIN)
NetLED43_2: LED43.2(DOUT) LED44.4(DIN)
NetLED44_2: LED44.2(DOUT) LED45.4(DIN)
NetLED45_2: LED45.2(DOUT) LED46.4(DIN)
NetLED46_2: LED46.2(DOUT) LED47.4(DIN)
NetLED47_2: LED47.2(DOUT) LED48.4(DIN)
NetLED49_2: LED49.2(DOUT) LED50.4(DIN)
NetLED50_2: LED50.2(DOUT) LED51.4(DIN)
NetLED51_2: LED51.2(DOUT) LED52.4(DIN)
NetLED52_2: LED52.2(DOUT) LED53.4(DIN)
NetLED53_2: LED53.2(DOUT) LED54.4(DIN)
NetLED54_2: LED54.2(DOUT) LED55.4(DIN)
NetLED55_2: LED55.2(DOUT) LED56.4(DIN)
NetLED56_2: LED56.2(DOUT) LED57.4(DIN)
NetLED57_2: LED57.2(DOUT) LED58.4(DIN)
NetLED58_2: LED58.2(DOUT) LED59.4(DIN)
NetLED59_2: LED59.2(DOUT) LED60.4(DIN)
NetLED60_2: LED60.2(DOUT) LED61.4(DIN)
NetLED61_2: LED61.2(DOUT) LED62.4(DIN)
NetLED62_2: LED62.2(DOUT) LED63.4(DIN)
NetLED63_2: LED63.2(DOUT) LED64.4(DIN)
NetLED65_2: LED65.2(DOUT) LED66.4(DIN)
NetLED66_2: LED66.2(DOUT) LED67.4(DIN)
NetLED67_2: LED67.2(DOUT) LED68.4(DIN)
NetLED68_2: LED68.2(DOUT) LED69.4(DIN)
NetLED69_2: LED69.2(DOUT) LED70.4(DIN)
NetLED70_2: LED70.2(DOUT) LED71.4(DIN)
NetLED71_2: LED71.2(DOUT) LED72.4(DIN)
NetLED72_2: LED72.2(DOUT) LED73.4(DIN)
NetLED73_2: LED73.2(DOUT) LED74.4(DIN)
NetLED74_2: LED74.2(DOUT) LED75.4(DIN)
NetLED75_2: LED75.2(DOUT) LED76.4(DIN)
NetLED76_2: LED76.2(DOUT) LED77.4(DIN)
NetLED77_2: LED77.2(DOUT) LED78.4(DIN)
NetLED78_2: LED78.2(DOUT) LED79.4(DIN)
NetLED79_2: LED79.2(DOUT) LED80.4(DIN)
NetLED81_2: LED81.2(DOUT) LED82.4(DIN)
NetLED82_2: LED82.2(DOUT) LED83.4(DIN)
NetLED83_2: LED83.2(DOUT) LED84.4(DIN)
NetLED84_2: LED84.2(DOUT) LED85.4(DIN)
NetLED85_2: LED85.2(DOUT) LED86.4(DIN)
NetLED86_2: LED86.2(DOUT) LED87.4(DIN)
NetLED87_2: LED87.2(DOUT) LED88.4(DIN)
NetLED88_2: LED88.2(DOUT) LED89.4(DIN)
NetLED89_2: LED89.2(DOUT) LED90.4(DIN)
NetLED90_2: LED90.2(DOUT) LED91.4(DIN)
NetLED91_2: LED91.2(DOUT) LED92.4(DIN)
NetLED92_2: LED92.2(DOUT) LED93.4(DIN)
NetLED93_2: LED93.2(DOUT) LED94.4(DIN)
NetLED94_2: LED94.2(DOUT) LED95.4(DIN)
NetLED95_2: LED95.2(DOUT) LED96.4(DIN)
NetLED97_2: LED97.2(DOUT) LED98.4(DIN)
NetLED98_2: LED98.2(DOUT) LED99.4(DIN)
NetLED99_2: LED99.2(DOUT) LED100.4(DIN)
NetLED100_2: LED100.2(DOUT) LED101.4(DIN)
NetLED101_2: LED101.2(DOUT) LED102.4(DIN)
NetLED102_2: LED102.2(DOUT) LED103.4(DIN)
NetLED103_2: LED103.2(DOUT) LED104.4(DIN)
NetLED104_2: LED104.2(DOUT) LED105.4(DIN)
NetLED105_2: LED105.2(DOUT) LED106.4(DIN)
NetLED106_2: LED106.2(DOUT) LED107.4(DIN)
NetLED107_2: LED107.2(DOUT) LED108.4(DIN)
NetLED108_2: LED108.2(DOUT) LED109.4(DIN)
NetLED109_2: LED109.2(DOUT) LED110.4(DIN)
NetLED110_2: LED110.2(DOUT) LED111.4(DIN)
NetLED111_2: LED111.2(DOUT) LED112.4(DIN)
NetLED113_2: LED113.2(DOUT) LED114.4(DIN)
NetLED114_2: LED114.2(DOUT) LED115.4(DIN)
NetLED115_2: LED115.2(DOUT) LED116.4(DIN)
NetLED116_2: LED116.2(DOUT) LED117.4(DIN)
NetLED117_2: LED117.2(DOUT) LED118.4(DIN)
NetLED118_2: LED118.2(DOUT) LED119.4(DIN)
NetLED119_2: LED119.2(DOUT) LED120.4(DIN)
NetLED120_2: LED120.2(DOUT) LED121.4(DIN)
NetLED121_2: LED121.2(DOUT) LED122.4(DIN)
NetLED122_2: LED122.2(DOUT) LED123.4(DIN)
NetLED123_2: LED123.2(DOUT) LED124.4(DIN)
NetLED124_2: LED124.2(DOUT) LED125.4(DIN)
NetLED125_2: LED125.2(DOUT) LED126.4(DIN)
NetLED126_2: LED126.2(DOUT) LED127.4(DIN)
NetLED127_2: LED127.2(DOUT) LED128.4(DIN)
NetLED129_2: LED129.2(DOUT) LED130.4(DIN)
NetLED130_2: LED130.2(DOUT) LED131.4(DIN)
NetLED131_2: LED131.2(DOUT) LED132.4(DIN)
NetLED132_2: LED132.2(DOUT) LED133.4(DIN)
NetLED133_2: LED133.2(DOUT) LED134.4(DIN)
NetLED134_2: LED134.2(DOUT) LED135.4(DIN)
NetLED135_2: LED135.2(DOUT) LED136.4(DIN)
NetLED136_2: LED136.2(DOUT) LED137.4(DIN)
NetLED137_2: LED137.2(DOUT) LED138.4(DIN)
NetLED138_2: LED138.2(DOUT) LED139.4(DIN)
NetLED139_2: LED139.2(DOUT) LED140.4(DIN)
NetLED140_2: LED140.2(DOUT) LED141.4(DIN)
NetLED141_2: LED141.2(DOUT) LED142.4(DIN)
NetLED142_2: LED142.2(DOUT) LED143.4(DIN)
NetLED143_2: LED143.2(DOUT) LED144.4(DIN)
NetLED145_2: LED145.2(DOUT) LED146.4(DIN)
NetLED146_2: LED146.2(DOUT) LED147.4(DIN)
NetLED147_2: LED147.2(DOUT) LED148.4(DIN)
NetLED148_2: LED148.2(DOUT) LED149.4(DIN)
NetLED149_2: LED149.2(DOUT) LED150.4(DIN)
NetLED150_2: LED150.2(DOUT) LED151.4(DIN)
NetLED151_2: LED151.2(DOUT) LED152.4(DIN)
NetLED152_2: LED152.2(DOUT) LED153.4(DIN)
NetLED153_2: LED153.2(DOUT) LED154.4(DIN)
NetLED154_2: LED154.2(DOUT) LED155.4(DIN)
NetLED155_2: LED155.2(DOUT) LED156.4(DIN)
NetLED156_2: LED156.2(DOUT) LED157.4(DIN)
NetLED157_2: LED157.2(DOUT) LED158.4(DIN)
NetLED158_2: LED158.2(DOUT) LED159.4(DIN)
NetLED159_2: LED159.2(DOUT) LED160.4(DIN)
NetLED161_2: LED161.2(DOUT) LED162.4(DIN)
NetLED162_2: LED162.2(DOUT) LED163.4(DIN)
NetLED163_2: LED163.2(DOUT) LED164.4(DIN)
NetLED164_2: LED164.2(DOUT) LED165.4(DIN)
NetLED165_2: LED165.2(DOUT) LED166.4(DIN)
NetLED166_2: LED166.2(DOUT) LED167.4(DIN)
NetLED167_2: LED167.2(DOUT) LED168.4(DIN)
NetLED168_2: LED168.2(DOUT) LED169.4(DIN)
NetLED169_2: LED169.2(DOUT) LED170.4(DIN)
NetLED170_2: LED170.2(DOUT) LED171.4(DIN)
NetLED171_2: LED171.2(DOUT) LED172.4(DIN)
NetLED172_2: LED172.2(DOUT) LED173.4(DIN)
NetLED173_2: LED173.2(DOUT) LED174.4(DIN)
NetLED174_2: LED174.2(DOUT) LED175.4(DIN)
NetLED175_2: LED175.2(DOUT) LED176.4(DIN)
NetLED177_2: LED177.2(DOUT) LED178.4(DIN)
NetLED178_2: LED178.2(DOUT) LED179.4(DIN)
NetLED179_2: LED179.2(DOUT) LED180.4(DIN)
NetLED180_2: LED180.2(DOUT) LED181.4(DIN)
NetLED181_2: LED181.2(DOUT) LED182.4(DIN)
NetLED182_2: LED182.2(DOUT) LED183.4(DIN)
NetLED183_2: LED183.2(DOUT) LED184.4(DIN)
NetLED184_2: LED184.2(DOUT) LED185.4(DIN)
NetLED185_2: LED185.2(DOUT) LED186.4(DIN)
NetLED186_2: LED186.2(DOUT) LED187.4(DIN)
NetLED187_2: LED187.2(DOUT) LED188.4(DIN)
NetLED188_2: LED188.2(DOUT) LED189.4(DIN)
NetLED189_2: LED189.2(DOUT) LED190.4(DIN)
NetLED190_2: LED190.2(DOUT) LED191.4(DIN)
NetLED191_2: LED191.2(DOUT) LED192.4(DIN)
NetLED193_2: LED193.2(DOUT) LED194.4(DIN)
NetLED194_2: LED194.2(DOUT) LED195.4(DIN)
NetLED195_2: LED195.2(DOUT) LED196.4(DIN)
NetLED196_2: LED196.2(DOUT) LED197.4(DIN)
NetLED197_2: LED197.2(DOUT) LED198.4(DIN)
NetLED198_2: LED198.2(DOUT) LED199.4(DIN)
NetLED199_2: LED199.2(DOUT) LED200.4(DIN)
NetLED200_2: LED200.2(DOUT) LED201.4(DIN)
NetLED201_2: LED201.2(DOUT) LED202.4(DIN)
NetLED202_2: LED202.2(DOUT) LED203.4(DIN)
NetLED203_2: LED203.2(DOUT) LED204.4(DIN)
NetLED204_2: LED204.2(DOUT) LED205.4(DIN)
NetLED205_2: LED205.2(DOUT) LED206.4(DIN)
NetLED206_2: LED206.2(DOUT) LED207.4(DIN)
NetLED207_2: LED207.2(DOUT) LED208.4(DIN)
NetLED209_2: LED209.2(DOUT) LED210.4(DIN)
NetLED210_2: LED210.2(DOUT) LED211.4(DIN)
NetLED211_2: LED211.2(DOUT) LED212.4(DIN)
NetLED212_2: LED212.2(DOUT) LED213.4(DIN)
NetLED213_2: LED213.2(DOUT) LED214.4(DIN)
NetLED214_2: LED214.2(DOUT) LED215.4(DIN)
NetLED215_2: LED215.2(DOUT) LED216.4(DIN)
NetLED216_2: LED216.2(DOUT) LED217.4(DIN)
NetLED217_2: LED217.2(DOUT) LED218.4(DIN)
NetLED218_2: LED218.2(DOUT) LED219.4(DIN)
NetLED219_2: LED219.2(DOUT) LED220.4(DIN)
NetLED220_2: LED220.2(DOUT) LED221.4(DIN)
NetLED221_2: LED221.2(DOUT) LED222.4(DIN)
NetLED222_2: LED222.2(DOUT) LED223.4(DIN)
NetLED223_2: LED223.2(DOUT) LED224.4(DIN)
NetLED225_2: LED225.2(DOUT) LED226.4(DIN)
NetLED226_2: LED226.2(DOUT) LED227.4(DIN)
NetLED227_2: LED227.2(DOUT) LED228.4(DIN)
NetLED228_2: LED228.2(DOUT) LED229.4(DIN)
NetLED229_2: LED229.2(DOUT) LED230.4(DIN)
NetLED230_2: LED230.2(DOUT) LED231.4(DIN)
NetLED231_2: LED231.2(DOUT) LED232.4(DIN)
NetLED232_2: LED232.2(DOUT) LED233.4(DIN)
NetLED233_2: LED233.2(DOUT) LED234.4(DIN)
NetLED234_2: LED234.2(DOUT) LED235.4(DIN)
NetLED235_2: LED235.2(DOUT) LED236.4(DIN)
NetLED236_2: LED236.2(DOUT) LED237.4(DIN)
NetLED237_2: LED237.2(DOUT) LED238.4(DIN)
NetLED238_2: LED238.2(DOUT) LED239.4(DIN)
NetLED239_2: LED239.2(DOUT) LED240.4(DIN)
NetLED241_2: LED241.2(DOUT) LED242.4(DIN)
NetLED242_2: LED242.2(DOUT) LED243.4(DIN)
NetLED243_2: LED243.2(DOUT) LED244.4(DIN)
NetLED244_2: LED244.2(DOUT) LED245.4(DIN)
NetLED245_2: LED245.2(DOUT) LED246.4(DIN)
NetLED246_2: LED246.2(DOUT) LED247.4(DIN)
NetLED247_2: LED247.2(DOUT) LED248.4(DIN)
NetLED248_2: LED248.2(DOUT) LED249.4(DIN)
NetLED249_2: LED249.2(DOUT) LED250.4(DIN)
NetLED250_2: LED250.2(DOUT) LED251.4(DIN)
NetLED251_2: LED251.2(DOUT) LED252.4(DIN)
NetLED252_2: LED252.2(DOUT) LED253.4(DIN)
NetLED253_2: LED253.2(DOUT) LED254.4(DIN)
NetLED254_2: LED254.2(DOUT) LED255.4(DIN)
NetLED255_2: LED255.2(DOUT) LED256.4(DIN)

Not connected (* = marked no-connect by the designer): LED256 2(DOUT)

### Library data of the parts
LED1-LED256 = RGB_WS2812C: BOM_Manufacturer: Worldsemi; Contributor: LCSC; SMT Type: Extend; BOM_Supplier: LCSC; BOM_Manufacturer Part: WS2812C; BOM_Supplier Part: C114587; BOM_JLCPCB SMD: Yes; spicePre: L; spiceSymbolName: WS2812C